# Altium schematic sheet motordriver-v5.0_peripherals.SchDoc
size 420 x 297 mm; SheetNumber: 2; SheetTotal: 13
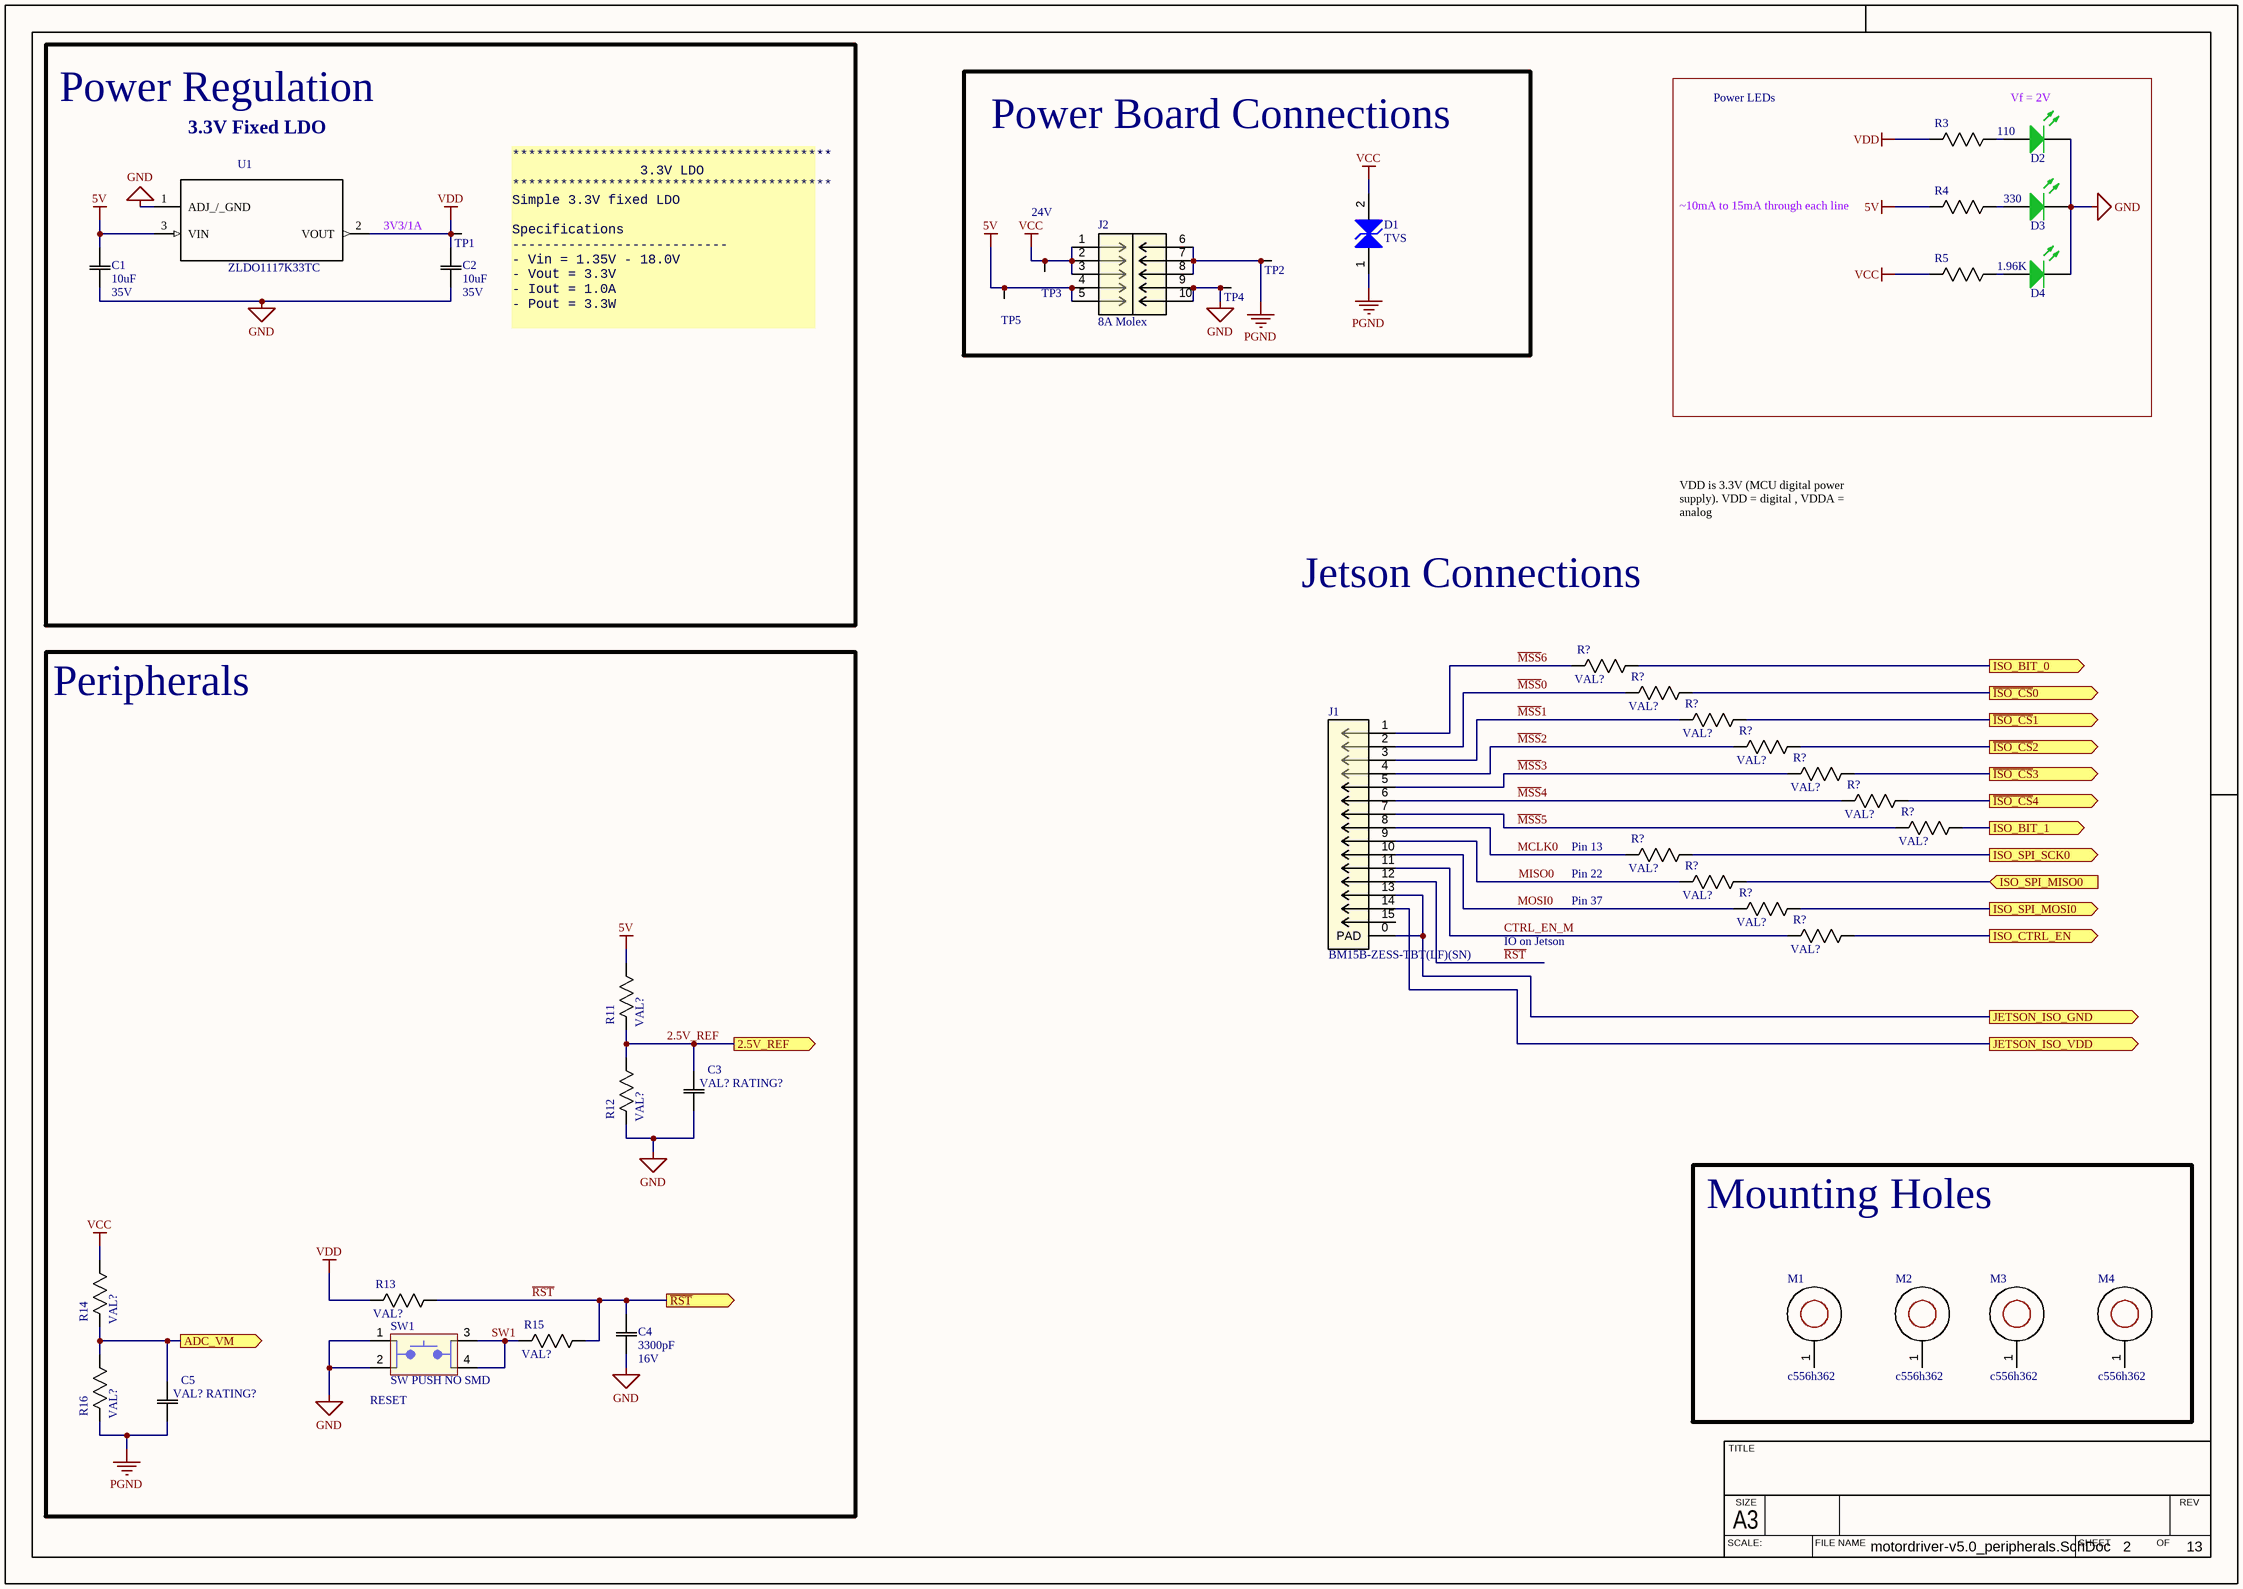
[diagram p0: motordriver-v5.0_peripherals.SchDoc]

## Parts
(Parts that share a designator on the sheet are numbered #1, #2 ... from top to bottom, then left to right.)
C1  value 10uF  Rating: 35V  [0805]  (hidden comment: VAL? RATING?)
C2  value 10uF  Rating: 35V  [0805]  (hidden comment: VAL? RATING?)
C3  VAL? RATING?  [0603]
C4  value 3300pF  Rating: 16V  [0603]  (hidden comment: VAL? RATING?)
C5  VAL? RATING?  [0603]
D1  TVS  [DO-214AC, SMA]
D2  LED2  [3.2X1.6X1.1]  (value not drawn)
D3  LED2  [3.2X1.6X1.1]  (value not drawn)
D4  LED2  [3.2X1.6X1.1]  (value not drawn)
J1  BM15B-ZESS-TBT(LF)(SN)  [JST ZE SMT 15POS]
J2  8A Molex  [MOLEX_0430451012]
M1  c556h362  [Mounting Hole c556h362]  (no BOM)
M2  c556h362  [Mounting Hole c556h362]  (no BOM)
M3  c556h362  [Mounting Hole c556h362]  (no BOM)
M4  c556h362  [Mounting Hole c556h362]  (no BOM)
R3  110  [0603]
R4  330  [0603]
R5  1.96K  [0603]
R11  VAL?  [0603]
R12  VAL?  [0603]
R13  VAL?  [0603]
R14  VAL?  [0603]
R15  VAL?  [0603]
R16  VAL?  [0603]
R?#1  VAL?  [0805]
R?#2  VAL?  [0805]
R?#3  VAL?  [0805]
R?#4  VAL?  [0805]
R?#5  VAL?  [0805]
R?#6  VAL?  [0805]
R?#7  VAL?  [0805]
R?#8  VAL?  [0805]
R?#9  VAL?  [0805]
R?#10  VAL?  [0805]
R?#11  VAL?  [0805]
SW1  SW PUSH NO SMD  [TL3305]
TP1  Test Point (Via)  [TP]  (value not drawn)
TP2  Test Point (Via)  [TP]  (value not drawn)
TP3  Test Point (Via)  [TP]  (value not drawn)
TP4  Test Point (Via)  [TP]  (value not drawn)
TP5  Test Point (Via)  [TP]  (value not drawn)
U1  ZLDO1117K33TC  [DPAK (TO-252)]

## Blocks framed on the sheet
Power Regulation: C1 C2 TP1 U1
Power Board Connections: D1 J2 TP2-TP5
Peripherals: C3-C5 R11-R16 SW1
Mounting Holes: M1-M4

## Ports
2.5V_REF (out), ADC_VM (out), ISO_BIT_0 (out), ISO_BIT_1 (out), ISO_CTRL_EN (out), ISO_SPI_MISO0 (in), ISO_SPI_MOSI0 (out), ISO_SPI_SCK0 (out), JETSON_ISO_GND (out), JETSON_ISO_VDD (out), ~{ISO_CS}0 (out), ~{ISO_CS}1 (out), ~{ISO_CS}2 (out), ~{ISO_CS}3 (out), ~{ISO_CS}4 (out), ~{RST} (out)

## Nets
5V: C1.2(C2) J2.4 J2.5 R4.2(R2) R11.1(R1) TP5.1 U1.3(VIN)
GND: C1.1(C1) C2.1(C1) C3.1(C1) C4.1(C1) D2.2(K) D3.2(K) D4.2(K) J2.9 J2.10 R12.2(R2) SW1.1 SW1.2 TP4.1 U1.1(ADJ_/_GND)
PGND: C5.1(C1) D1.1(K) J2.6 J2.7 J2.8 R16.2(R2) TP2.1
VCC: D1.2(A) J2.1 J2.2 J2.3 R5.2(R2) R14.1(R1) TP3.1
VDD: C2.2(C2) R3.2(R2) R13.2(R2) TP1.1 U1.2(VOUT)
2.5V_REF: C3.2(C2) R11.2(R2) R12.1(R1) ; port 2.5V_REF
ADC_VM: C5.2(C2) R14.2(R2) R16.1(R1) ; port ADC_VM
CTRL_EN_M: J1.11 R?#11.2(R2)
~{ISO_CS}0: R?#2.1(R1) ; port ~{ISO_CS}0
~{ISO_CS}1: R?#3.1(R1) ; port ~{ISO_CS}1
~{ISO_CS}2: R?#4.1(R1) ; port ~{ISO_CS}2
~{ISO_CS}3: R?#5.1(R1) ; port ~{ISO_CS}3
~{ISO_CS}4: R?#6.1(R1) ; port ~{ISO_CS}4
ISO_BIT_0: R?#1.1(R1) ; port ISO_BIT_0
ISO_BIT_1: R?#7.1(R1) ; port ISO_BIT_1
ISO_CTRL_EN: R?#11.1(R1) ; port ISO_CTRL_EN
ISO_SPI_MISO0: R?#9.1(R1) ; port ISO_SPI_MISO0
ISO_SPI_MOSI0: R?#10.1(R1) ; port ISO_SPI_MOSI0
ISO_SPI_SCK0: R?#8.1(R1) ; port ISO_SPI_SCK0
JETSON_ISO_GND: J1.0(PAD) J1.13 ; port JETSON_ISO_GND
JETSON_ISO_VDD: J1.14 ; port JETSON_ISO_VDD
~{MSS}0: J1.2 R?#2.2(R2)
~{MSS}1: J1.3 R?#3.2(R2)
~{MSS}2: J1.4 R?#4.2(R2)
~{MSS}3: J1.5 R?#5.2(R2)
~{MSS}4: J1.6 R?#6.2(R2)
~{MSS}5: J1.7 R?#7.2(R2)
~{MSS}6: J1.1 R?#1.2(R2)
MCLK0: J1.8 R?#8.2(R2)
MISO0: J1.9 R?#9.2(R2)
MOSI0: J1.10 R?#10.2(R2)
~{RST}: C4.2(C2) J1.12 R13.1(R1) R15.1(R1) ; port ~{RST}
SW1: R15.2(R2) SW1.3 SW1.4
NetD2_1: D2.1(A) R3.1(R1)
NetD3_1: D3.1(A) R4.1(R1)
NetD4_1: D4.1(A) R5.1(R1)

Not connected (* = marked no-connect by the designer): J1 15; M1 1; M2 1; M3 1; M4 1

## Notes on the sheet
- Power LEDs
- Vf = 2V
- 3.3V Fixed LDO
- 3V3/1A
- 24V
- ~10mA to 15mA through each line
- ****************************************
  3.3V LDO
  ****************************************
  Simple 3.3V fixed LDO
  Specifications
  ---------------------------
  - Vin = 1.35V - 18.0V
  - Vout = 3.3V
  - Iout = 1.0A
  - Pout = 3.3W
- Jetson Connections
- VDD is 3.3V (MCU digital power supply). VDD = digital , VDDA = analog
- (near R?#8) Pin 13
- (near R?#8) Pin 37
- (near R?#8) Pin 22
- IO on Jetson
- (near SW1) RESET
- TITLE
- SCALE:
- A3
- SIZE
- FILE NAME
- SHEET
- OF
- REV

## Library data of the parts
C1 C2 = CAP 10uF 35V_1: Default Symbol for Capacitors; Manufacturer Part Number 1: C2012X5R1V106K125AC; Tolerance: 10%; Temperature Coefficient: X5R; Part Number: CAP 10uF 35V_1; Supplier 1: Digi-Key; Supplier Part Number 1: 445-14418-1-ND
C3 C5 = CAP 100nF 50V: Default Symbol for Capacitors; Manufacturer Part Number 1: CC0603KPX7R9BB104; Value: 100nF; Tolerance: 10%; Rating: 50V; Temperature Coefficient: X7R; Part Number: CAP 100nF 50V; Supplier 1: Digi-Key; Supplier Part Number 1: 311-3567-1-ND; Manufacturer Part Number 2: 0805J0500104KJT; Supplier 2: Digi-Key; Supplier Part Number 2: 1608-1458-1-ND
C4 = CAP 3300pF 16V: Default Symbol for Capacitors; Manufacturer Part Number 1: C0603C332K4RACAUTO; Tolerance: 10%; Temperature Coefficient: X5R; Part Number: CAP 3300pF 16V; Supplier 1: Digi-Key; Supplier Part Number 1: 399-6881-1-ND; Manufacturer Part Number 2: C0805C332K4RAC7800; Supplier 2: Digi-Key; Supplier Part Number 2: 399-14593-1-ND
D1 = DIODE TVS 26VWM 53.5VC SMA: TVS DIODE 26V 53.5V SMA; Manufacturer Part Number: SMAJ26CA-TR; Power: 400W; Voltage Rating - DC: 26VWM, 53.5VC; Current Rating: 43A; Supplier 1: Digi-Key; Supplier Part Number 1: 497-12523-1-ND; Part Number: DIODE TVS 26VWM 53.5VC SMA; Supplier URL 1: https://www.digikey.ca/en/products/detail/stmicroelectronics/SMAJ26CA-TR/2214530?s=N4IgTCBcDaICwE4DsBaAjGArGAzOlAcgCIgC6AvkA; Pin Count: 2
D2-D4 = LED GREEN SMD: Typical RED, GREEN, YELLOW, AMBER GaAs LED; Voltage - Forward (Vf) (Typ): 2V; Lens Transparency: Clear; Current - Test: 20mA; Package: 1206; Color: Green
J1 = CN 15POS JST ZE SMT: CONN HEADER VERT SMD 15POS ZE; Supplier 1: Digi-Key; Supplier Part Number 1: 455-4211-1-ND; Part Number: CN 15POS JST ZE SMT; Manufacturer Part Number: BM15B-ZESS-TBT(LF)(SN); Supplier URL 1: https://www.digikey.ca/en/products/detail/jst-sales-america-inc/BM15B-ZESS-TBT-LF-SN/1886999?s=N4IgTCBcDaIEIFkCMBWOBaAWgUQMq-QBU5CAKAGQDEBKU3AOWpAF0BfIA; Pin Count: 15
J2 = CN HDR 10POS MOLEX 0430451012: CONN HEADER VERT 10POS 3MM; Supplier 1: Digi-Key; Manufacturer Part Number: 0430451012; Supplier Part Number 1: 455-1696-1-ND; Part Number: CN HDR 10POS MOLEX 0430451012; Supplier URL 1: https://www.digikey.ca/en/products/detail/molex/0430451012/252506?s=N4IgTCBcDaIAwBYDMiCsBGO6IF0C%2BQA; Pin Count: 10
M1-M4 = MOUNTING HOLE: Mounting Hole, Plated, Through Hole, Via 5.557mm, Hole 3.618mm; Hole Size: 3.618mm; Via Size: 5.557mm
R3 = RES 110.0 1/8W - 1%: RES SMD 110 OHM 1% 1/8W 0805/0603; Power (Watts): 0.125W; Package: 0805; Value: 110; Tolerance: 1%
R4 = RES 330.0 1/8W - 5%: RES SMD 330 OHM 5% 1/8W 0805; Power (Watts): 0.125W; Package: 0805; Value: 330; Tolerance: 5%
R5 = RES 1.96k 1/8W: RES SMD 1.96K OHM 1% 1/8W 0805; Power (Watts): 0.125W; Package: 0805; Value: 1.96k; Tolerance: 1%
R11 R12 = RES 4.7k 1/8W - 1%: Default Resistor Symbol; Value: 1; Power (Watts): 0.125W; Tolerance: 5%; Package: 0805; Part Number: RES 4.7k 1/8W - 1%
R13 = RES 39k 1/8W: Default Resistor Symbol; Manufacturer Part Number 1: CRG0805F39K; Value: 39k; Power (Watts): 0.125W; Tolerance: 1%; Tolerance 2: 0.05%; Package: 0805; Part Number: RES 39k 1/8W; Supplier 1: Digi-Key; Supplier Part Number 1: A126366CT-ND; Manufacturer Part Number 2: ERA-3VRW3902V; Supplier 2: Digi-Key; Supplier Part Number 2: 10-ERA-3VRW3902VCT-ND
R14 = RES 47k 1/8W - 1%: Default Resistor Symbol; Manufacturer Part Number 1: MCT06030C4702FP500; Value: 47k; Power (Watts): 0.125W; Tolerance: 1%; Package: 0805; Part Number: RES 47k 1/8W - 1%; Supplier 1: Digi-Key; Supplier Part Number 1: MCT0603-47.0K-CFCT-ND; Manufacturer Part Number 2: AC0805FR-0747KL; Supplier 2: Digi-Key; Supplier Part Number 2: YAG3735CT-ND; Tolerance 2: 1%
R15 R?#1-R?#11 = RES 100.0 1/8W - 5%: Default Resistor Symbol; Manufacturer Part Number 1: RMCF0805JT100R; Value: 100; Power (Watts): 0.125W; Tolerance: 5%; Package: 0805; Part Number: RES 100.0 1/8W - 5%; Supplier 1: Digi-Key; Supplier Part Number 1: RMCF0805JT100RCT-ND; Manufacturer Part Number 2: RK73B1JRTTD101J; Supplier 2: Digi-Key; Supplier Part Number 2: 2019-RK73B1JRTTD101JCT-ND; Tolerance 2: 5%
R16 = RES 1k 1/8W - 1%: Default Resistor Symbol; Manufacturer Part Number 1: MCT06030C1001FP500; Value: 1k; Power (Watts): 0.125W; Tolerance: 1%; Package: 0805; Part Number: RES 1k 1/8W - 1%; Supplier 1: Digi-Key; Supplier Part Number 1: MCT0603-1.00K-CFCT-ND; Manufacturer Part Number 2: RMCF0805FT1K00; Supplier 2: Digi-Key; Supplier Part Number 2: RMCF0805FT1K00CT-ND; Tolerance 2: 1%
SW1 = SW PUSH NO SMD: Switch Tactile N.O. SPST Round Button Gull Wing 0.05A 12VDC 2.55N SMD T/R; Manufacturer Part Number: TL3305BF260QG / TL3305BF260QG; Supplier 1: Digi-Key; Supplier Part Number 1: EG5354CT-ND; Part Number: SW PUSH NO SMD; Supplier URL 1: https://www.digikey.ca/en/products/detail/e-switch/TL3305BF260QG/5816185?s=N4IgTCBcDaIKIHECsBmJAWAwgFQLQDkAREAXQF8g
U1 = ZLDO1117K33TC: Linear Voltage Regulator IC Positive Fixed 1 Output  1A TO-252-3; MF: Diodes Incorporated; Package: TO-252-3; MP: ZLDO1117K33TC; Digikey: ZLDO1117K33DIDKR-ND; Digikey Link: https://www.digikey.ca/product-detail/en/diodes-incorporated/ZLDO1117K33TC/ZLDO1117K33DIDKR-ND/2095639; Supplier 1: Digi-Key; Supplier Part Number 1: ZLDO1117K33DICT-ND; Part Number: ZLDO1117K33TC; Manufacturer Part Number: ZLDO1117K33TC; Suppler URL 1: https://www.digikey.ca/product-detail/en/diodes-incorporated/ZLDO1117K33TC/ZLDO1117K33DIDKR-ND/2095639
TP1-TP5 = Test Point (Via): Part Number: Test Point (Via)